# EAGLE design CktoADC (EAGLE 5.11)

## Sheet 1 of 2
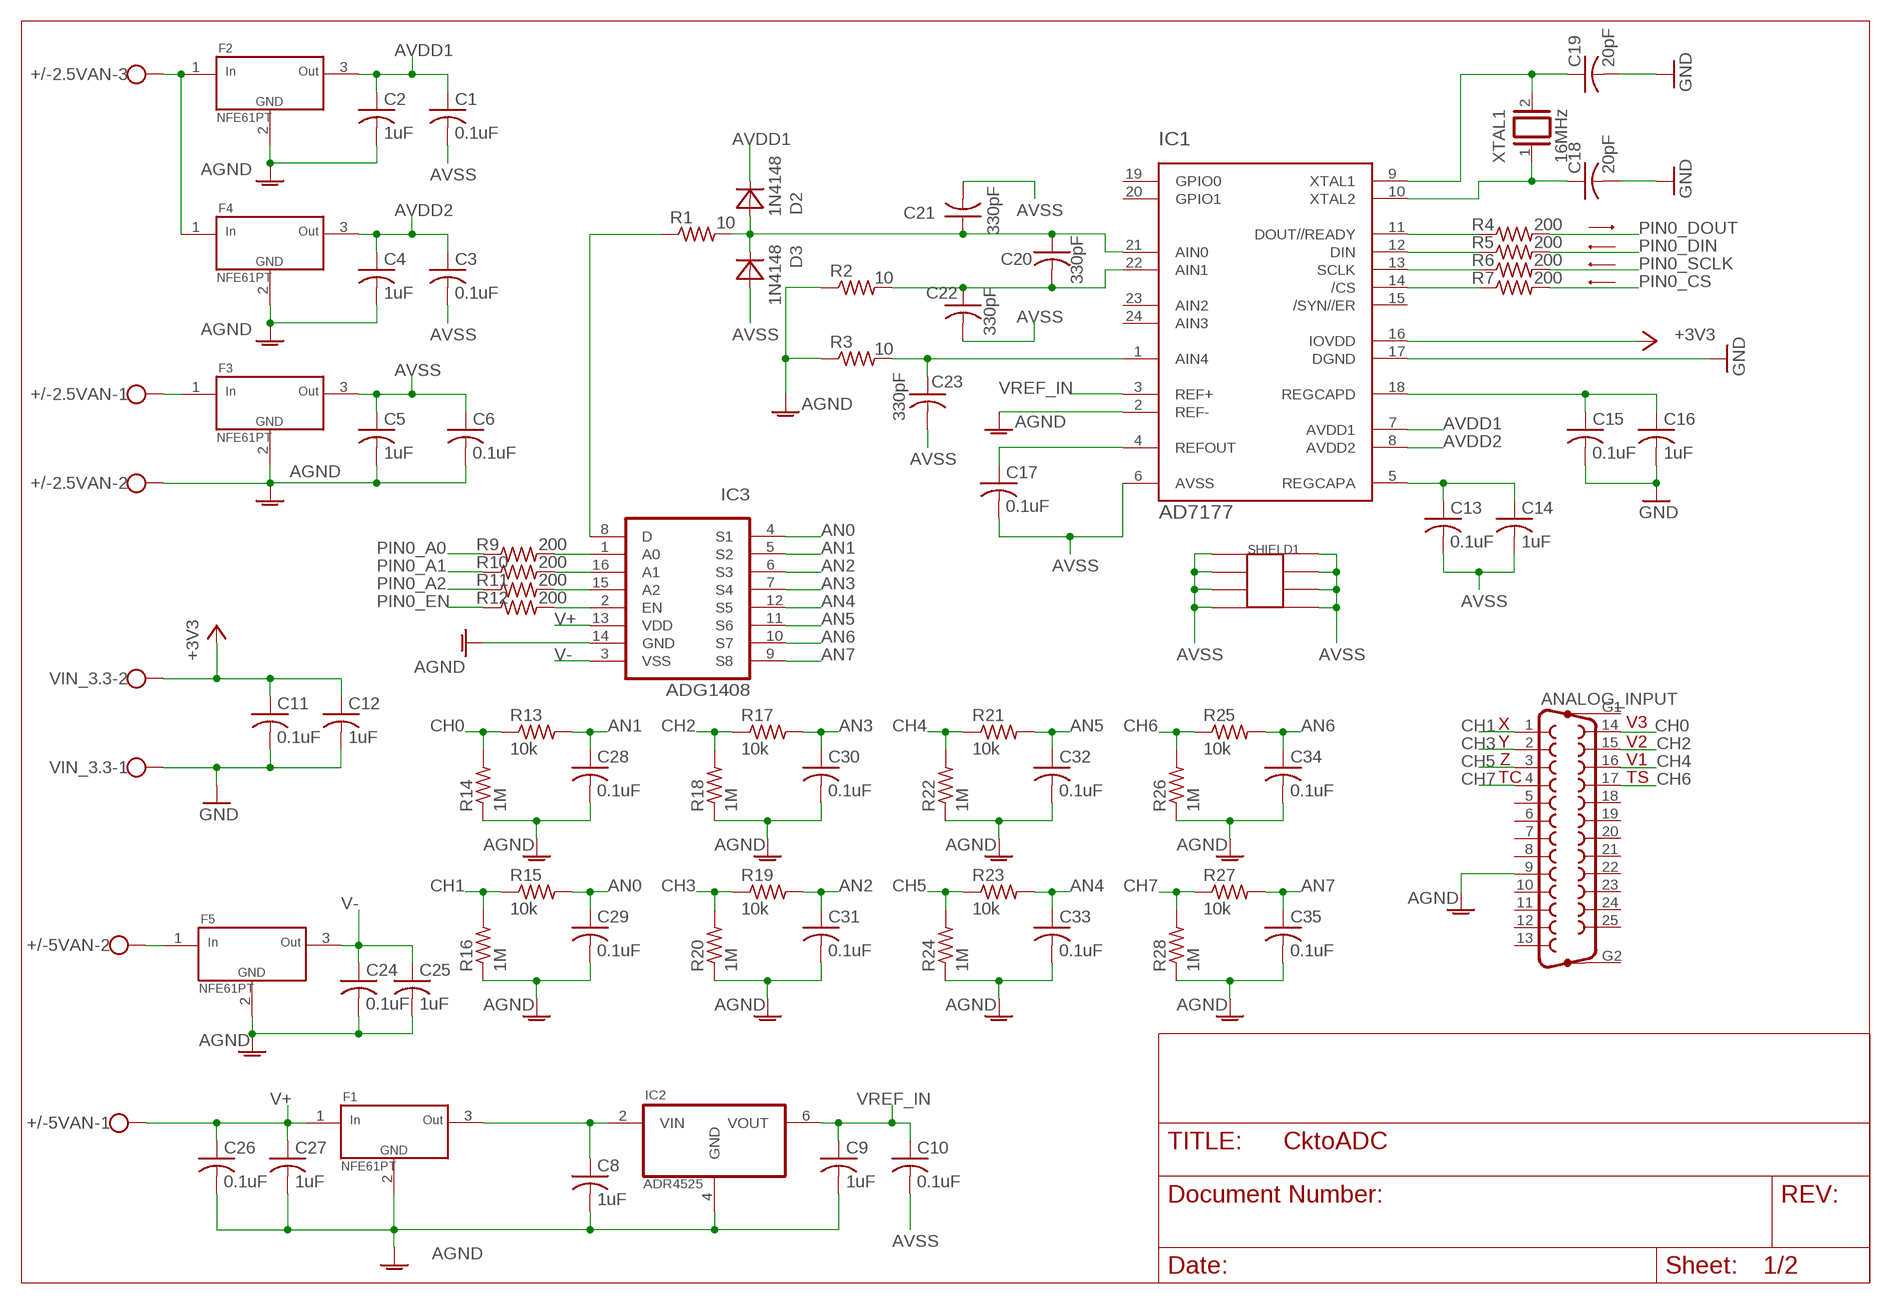
[diagram p0: schematic, sheet 1]

### Parts
+/-2.5VAN  W237-103  [W237-103]
+/-5VAN  W237-102  [W237-102]
ANALOG_INPUT  F25HP  [F25HP]
C1  0.1uF  C-USC0402  [C0402]
C2  1uF  C-USC0603  [C0603]
C3  0.1uF  C-USC0402  [C0402]
C4  1uF  C-USC0603  [C0603]
C5  1uF  C-USC0603  [C0603]
C6  0.1uF  C-USC0402  [C0402]
C8  1uF  C-USC0603  [C0603]
C9  1uF  C-USC0603  [C0603]
C10  0.1uF  C-USC0402  [C0402]
C11  0.1uF  C-USC0402  [C0402]
C12  1uF  C-USC0402  [C0402]
C13  0.1uF  C-USC0402  [C0402]
C14  1uF  C-USC0402  [C0402]
C15  0.1uF  C-USC0402  [C0402]
C16  1uF  C-USC0402  [C0402]
C17  0.1uF  C-USC0402  [C0402]
C18  20pF  C-USC0603  [C0603]
C19  20pF  C-USC0603  [C0603]
C20  330pF  C-USC0805  [C0805]
C21  330pF  C-USC0805  [C0805]
C22  330pF  C-USC0805  [C0805]
C23  330pF  C-USC0805  [C0805]
C24  0.1uF  C-USC0402  [C0402]
C25  1uF  C-USC0402  [C0402]
C26  0.1uF  C-USC0402  [C0402]
C27  1uF  C-USC0402  [C0402]
C28  0.1uF  C-USC0603  [C0603]
C29  0.1uF  C-USC0603  [C0603]
C30  0.1uF  C-USC0603  [C0603]
C31  0.1uF  C-USC0603  [C0603]
C32  0.1uF  C-USC0603  [C0603]
C33  0.1uF  C-USC0603  [C0603]
C34  0.1uF  C-USC0603  [C0603]
C35  0.1uF  C-USC0603  [C0603]
D2  1N4148  DIODE  [DIODE]
D3  1N4148  DIODE  [DIODE]
F1  NFE61PT  EMIFIL  [NFE-2706]
F2  NFE61PT  EMIFIL  [NFE-2706]
F3  NFE61PT  EMIFIL  [NFE-2706]
F4  NFE61PT  EMIFIL  [NFE-2706]
F5  NFE61PT  EMIFIL  [NFE-2706]
IC1  AD7177  AD7177-2  [TSSOP24]
IC2  ADR4525  [SOIC8]
IC3  ADG1408  [TSSOP16]
R1  10  R-US_R0603  [R0603]
R2  10  R-US_R0603  [R0603]
R3  10  R-US_R0603  [R0603]
R4  200  R-US_R0603  [R0603]
R5  200  R-US_R0603  [R0603]
R6  200  R-US_R0603  [R0603]
R7  200  R-US_R0603  [R0603]
R9  200  R-US_R0603  [R0603]
R10  200  R-US_R0603  [R0603]
R11  200  R-US_R0603  [R0603]
R12  200  R-US_R0603  [R0603]
R13  10k  R-US_R0603  [R0603]
R14  1M  R-US_R0603  [R0603]
R15  10k  R-US_R0603  [R0603]
R16  1M  R-US_R0603  [R0603]
R17  10k  R-US_R0603  [R0603]
R18  1M  R-US_R0603  [R0603]
R19  10k  R-US_R0603  [R0603]
R20  1M  R-US_R0603  [R0603]
R21  10k  R-US_R0603  [R0603]
R22  1M  R-US_R0603  [R0603]
R23  10k  R-US_R0603  [R0603]
R24  1M  R-US_R0603  [R0603]
R25  10k  R-US_R0603  [R0603]
R26  1M  R-US_R0603  [R0603]
R27  10k  R-US_R0603  [R0603]
R28  1M  R-US_R0603  [R0603]
SHIELD1  SHIELD_50X38  [SHIELD_38X50]
VIN_3.3  W237-102  [W237-102]
XTAL1  16MHz  XTAL  [XTAL]

### Nets
+3V3: C11.1 C12.1 IC1.16(IOVDD) VIN_3.3.2 ; also sheet 2
AGND: +/-2.5VAN.2 ANALOG_INPUT.9 C2.2 C4.2 C5.2 C6.2 C8.2 C9.2 C24.2 C25.2 C26.2 C27.2 C28.2 C29.2 C30.2 C31.2 C32.2 C33.2 C34.2 C35.2 F1.2 F2.2 F3.2 F4.2 F5.2 IC1.2(REF-) IC2.4(GND) IC3.14(GND) R2.1 R3.1 R14.1 R16.1 R18.1 R20.1 R22.1 R24.1 R26.1 R28.1
AN0: C29.1 IC3.4(S1) R15.2
AN1: C28.1 IC3.5(S2) R13.2
AN2: C31.1 IC3.6(S3) R19.2
AN3: C30.1 IC3.7(S4) R17.2
AN4: C33.1 IC3.12(S5) R23.2
AN5: C32.1 IC3.11(S6) R21.2
AN6: C34.1 IC3.10(S7) R25.2
AN7: C35.1 IC3.9(S8) R27.2
AVDD1: C1.1 C2.1 D2.K F2.3 IC1.7(AVDD1)
AVDD2: C3.1 C4.1 F4.3 IC1.8(AVDD2)
AVSS: C1.2 C3.2 C5.1 C6.1 C10.2 C13.2 C14.2 C17.2 C21.2 C22.2 C23.2 D3.A F3.3 IC1.6(AVSS) SHIELD1.P$1 SHIELD1.P$2 SHIELD1.P$3 SHIELD1.P$4 SHIELD1.P$5 SHIELD1.P$6 SHIELD1.P$7 SHIELD1.P$8
CH0: ANALOG_INPUT.14 R13.1 R14.2
CH1: ANALOG_INPUT.1 R15.1 R16.2
CH2: ANALOG_INPUT.15 R17.1 R18.2
CH3: ANALOG_INPUT.2 R19.1 R20.2
CH4: ANALOG_INPUT.16 R21.1 R22.2
CH5: ANALOG_INPUT.3 R23.1 R24.2
CH6: ANALOG_INPUT.17 R25.1 R26.2
CH7: ANALOG_INPUT.4 R27.1 R28.2
GND: C11.2 C12.2 C15.2 C16.2 C18.2 C19.2 IC1.17(DGND) VIN_3.3.1 ; also sheet 2
N$1: +/-2.5VAN.3 F2.1 F4.1
N$2: +/-2.5VAN.1 F3.1
N$4: C8.1 F1.3 IC2.2(VIN)
N$5: C15.1 C16.1 IC1.18(REGCAPD)
N$6: C20.1 C21.1 D2.A D3.K IC1.21(AIN0) R1.2
N$7: C17.1 IC1.4(REFOUT)
N$8: C13.1 C14.1 IC1.5(REGCAPA)
N$9: C18.1 IC1.10(XTAL2) XTAL1.1
N$10: C19.1 IC1.9(XTAL1) XTAL1.2
N$11: C20.2 C22.1 IC1.22(AIN1) R2.2
N$12: C23.1 IC1.1(AIN4) R3.2
N$13: +/-5VAN.2 F5.1
N$15: IC1.11(DOUT//READY) R4.1
N$16: IC1.12(DIN) R5.1
N$17: IC1.13(SCLK) R6.1
N$18: IC1.14(/CS) R7.1
N$19: IC3.1(A0) R9.2
N$20: IC3.16(A1) R10.2
N$21: IC3.15(A2) R11.2
N$22: IC3.2(EN) R12.2
N$23: IC3.8(D) R1.1
PIN0_A0: R9.1 ; also sheet 2
PIN0_A1: R10.1 ; also sheet 2
PIN0_A2: R11.1 ; also sheet 2
PIN0_CS: R7.2 ; also sheet 2
PIN0_DIN: R5.2 ; also sheet 2
PIN0_DOUT: R4.2 ; also sheet 2
PIN0_EN: R12.1 ; also sheet 2
PIN0_SCLK: R6.2 ; also sheet 2
V+: +/-5VAN.1 C26.1 C27.1 F1.1 IC3.13(VDD)
V-: C24.1 C25.1 F5.3 IC3.3(VSS)
VREF_IN: C9.1 C10.1 IC1.3(REF+) IC2.6(VOUT)
Unconnected: ANALOG_INPUT.5 ANALOG_INPUT.6 ANALOG_INPUT.7 ANALOG_INPUT.8 ANALOG_INPUT.10 ANALOG_INPUT.11 ANALOG_INPUT.12 ANALOG_INPUT.13 ANALOG_INPUT.18 ANALOG_INPUT.19 ANALOG_INPUT.20 ANALOG_INPUT.21 ANALOG_INPUT.22 ANALOG_INPUT.23 ANALOG_INPUT.24 ANALOG_INPUT.25 ANALOG_INPUT.G1 ANALOG_INPUT.G2 IC1.15(/SYN//ER) IC1.19(GPIO0) IC1.20(GPIO1) IC1.23(AIN2) IC1.24(AIN3)

### Notes on the sheet
- X | V3
- Y | V2
- Z | V1
- TC | TS

## Sheet 2 of 2
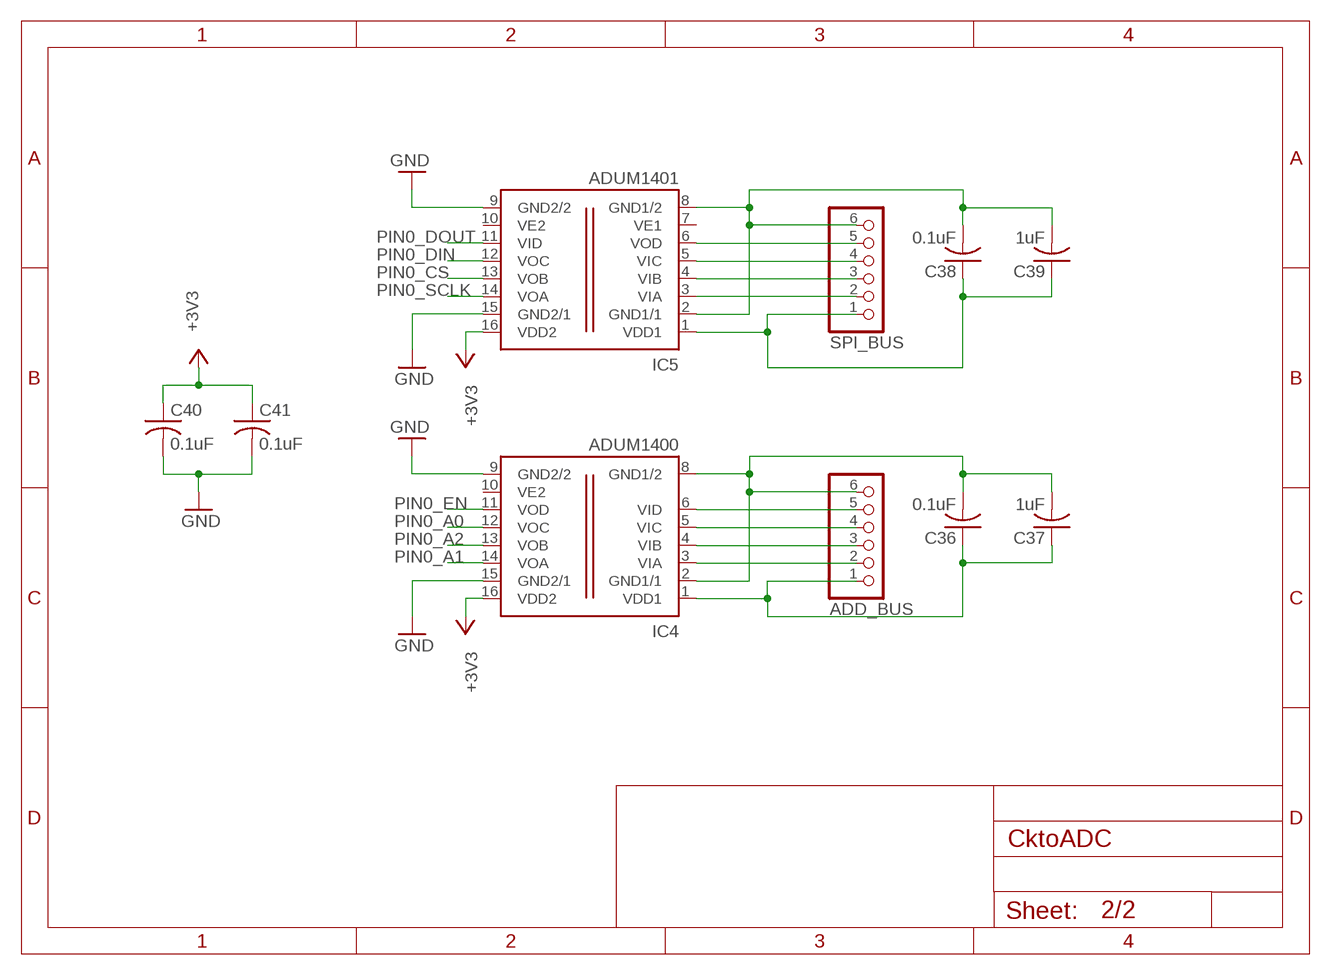
[diagram p1: schematic, sheet 2]

### Parts
ADD_BUS  PINHD-1X6  [1X06]
C36  0.1uF  C-USC0603  [C0603]
C37  1uF  C-USC0603  [C0603]
C38  0.1uF  C-USC0603  [C0603]
C39  1uF  C-USC0603  [C0603]
C40  0.1uF  C-USC0603  [C0603]
C41  0.1uF  C-USC0603  [C0603]
IC4  ADUM1400  [SO-16W]
IC5  ADUM1401  [SO-16W]
SPI_BUS  PINHD-1X6  [1X06]

### Nets
+3V3: C40.1 C41.1 IC4.16(VDD2) IC5.16(VDD2) ; also sheet 1
GND: C40.2 C41.2 IC4.9(GND2/2) IC4.15(GND2/1) IC5.9(GND2/2) IC5.15(GND2/1) ; also sheet 1
N$3: ADD_BUS.2 IC4.3(VIA)
N$24: ADD_BUS.3 IC4.4(VIB)
N$25: ADD_BUS.4 IC4.5(VIC)
N$26: ADD_BUS.5 IC4.6(VID)
N$27: ADD_BUS.1 C36.1 C37.1 IC4.1(VDD1)
N$30: ADD_BUS.6 C36.2 C37.2 IC4.2(GND1/1) IC4.8(GND1/2)
N$34: IC5.3(VIA) SPI_BUS.2
N$35: IC5.4(VIB) SPI_BUS.3
N$36: IC5.5(VIC) SPI_BUS.4
N$37: IC5.6(VOD) SPI_BUS.5
N$38: C38.1 C39.1 IC5.1(VDD1) SPI_BUS.1
N$39: C38.2 C39.2 IC5.2(GND1/1) IC5.8(GND1/2) SPI_BUS.6
PIN0_A0: IC4.12(VOC) ; also sheet 1
PIN0_A1: IC4.14(VOA) ; also sheet 1
PIN0_A2: IC4.13(VOB) ; also sheet 1
PIN0_CS: IC5.13(VOB) ; also sheet 1
PIN0_DIN: IC5.12(VOC) ; also sheet 1
PIN0_DOUT: IC5.11(VID) ; also sheet 1
PIN0_EN: IC4.11(VOD) ; also sheet 1
PIN0_SCLK: IC5.14(VOA) ; also sheet 1
Unconnected: IC4.10(VE2) IC5.7(VE1) IC5.10(VE2)

## Library data of the parts
+/-2.5VAN = con-wago-500:W237-103: WAGO SCREW CLAMP; MPN: 237-103; OC_FARNELL: unknown; OC_NEWARK: 18M7116
+/-5VAN VIN_3.3 = con-wago-500:W237-102: WAGO SCREW CLAMP; MPN: 237-102; OC_FARNELL: unknown; OC_NEWARK: 70K9898
ADD_BUS SPI_BUS = pinhead:PINHD-1X6: PIN HEADER
ANALOG_INPUT = con-subd:F25HP: SUB-D; OC_FARNELL: unknown; OC_NEWARK: unknown
C1-C6 C8-C41 = rcl:C-US: CAPACITOR, American symbol
D2 D3 = Ricardo_Library:DIODE
F1-F5 = magnetometro:EMIFIL
IC1 = magnetometro:AD7177-2
IC2 = magnetometro:ADR4525
IC3 = magnetometro:ADG1408
IC4 = Ricardo_Library:ADUM1400
IC5 = Ricardo_Library:ADUM1401
R1-R7 R9-R28 = rcl:R-US_: RESISTOR, American symbol
SHIELD1 = magnetometro:SHIELD_50X38
XTAL1 = Ricardo_Library:XTAL

## Board
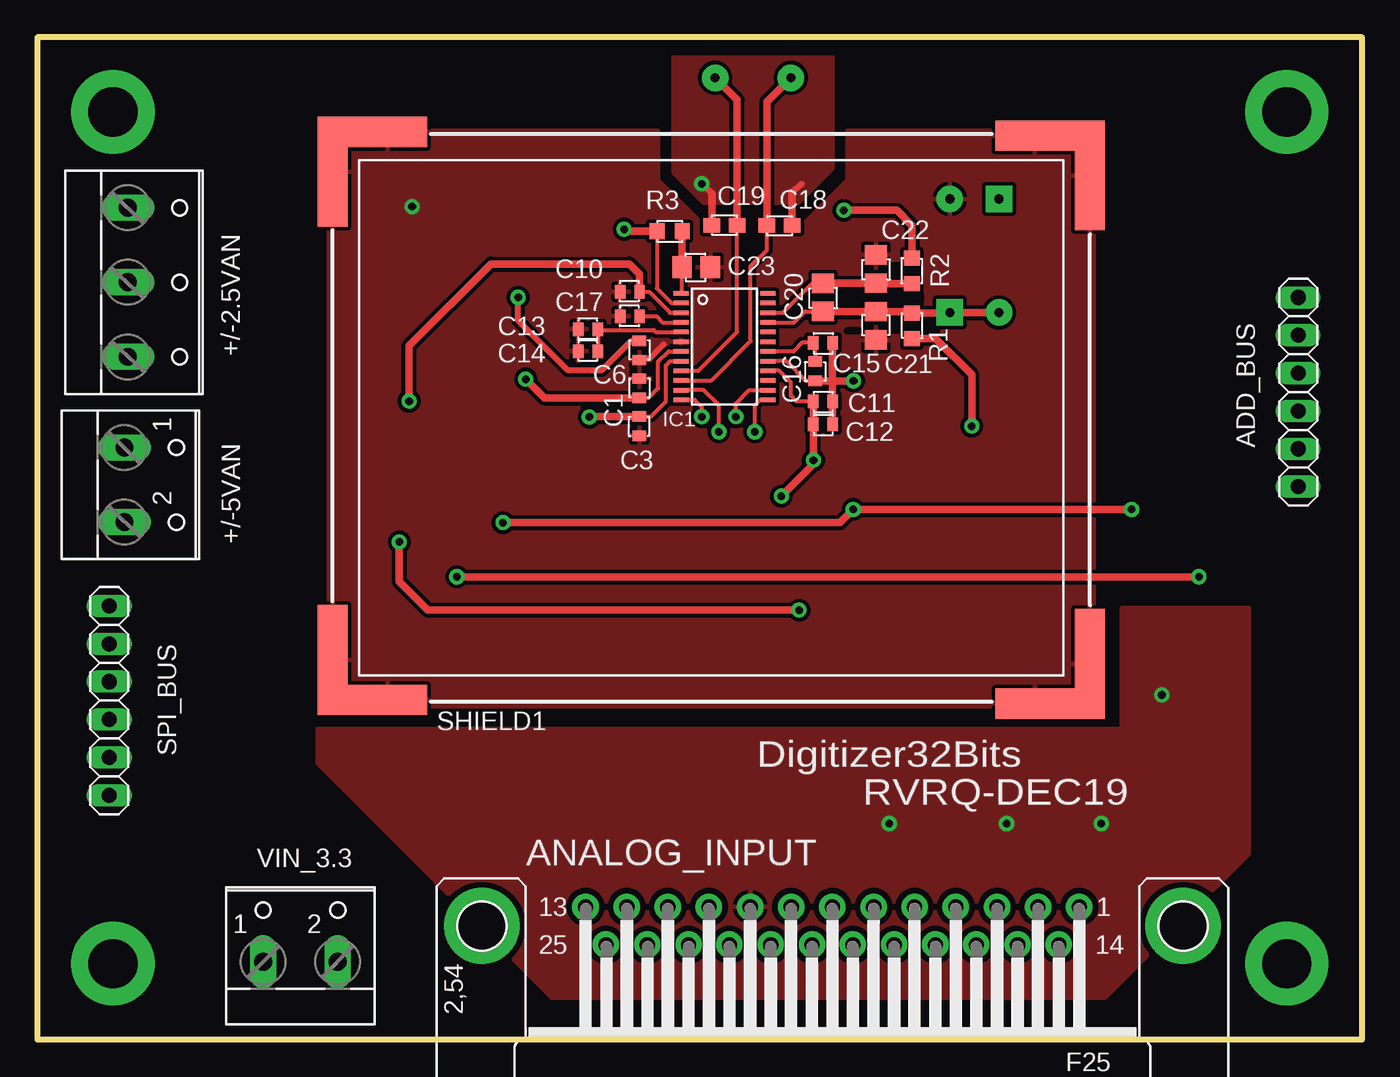
[diagram p2: board, top side]
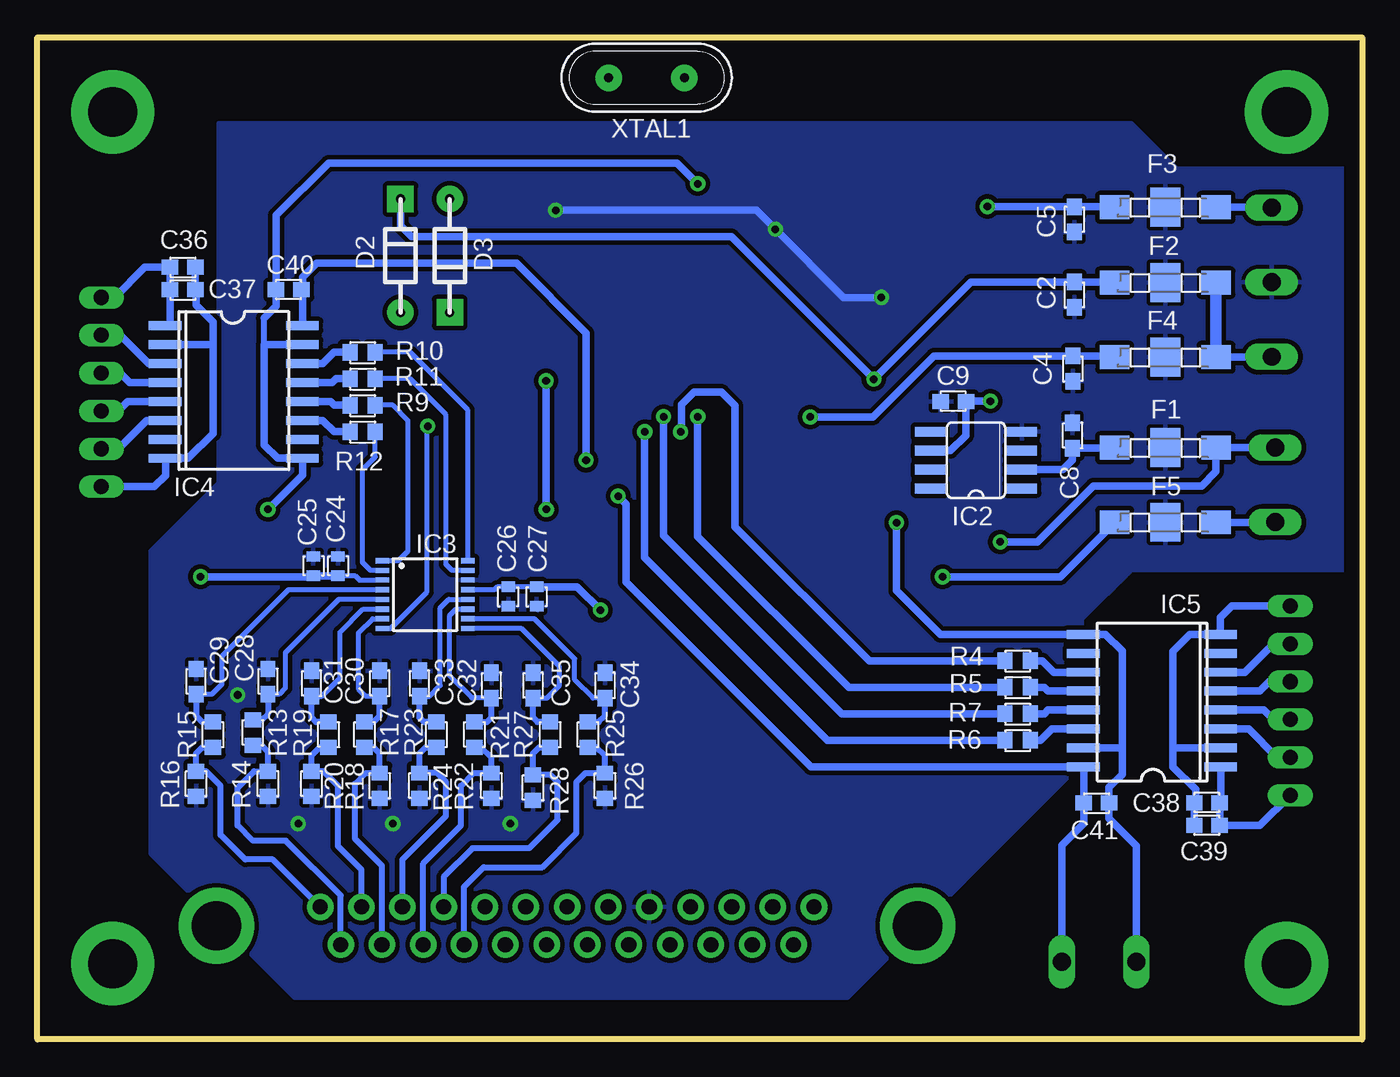
[diagram p3: board, bottom side, seen from below]

Size 88.88 x 67.23 mm. Coordinates in mm from the lower left corner, seen from the top.
Outline: 0,0 88.88,0 88.88,67.23 0,67.23 0,0
Copper layers (1*16): Top 0.035mm / dielectric 1.5mm / Bottom 0.035mm
Design rules "default": minimum track width 10mil, minimum drill 24mil, track to track 8mil, track to pad 8mil, pad to pad 8mil, via to via 8mil, smd to smd 8mil, copper to edge 40mil, drill to drill 8mil, minimum pad ring 10mil, minimum via ring 8mil, stop-mask expansion 4mil, vias tented up to drill 0mil, thermal gap 10mil
tRestrict: 4 lines
bRestrict: 1 lines

### Footprints (pad centres in the part's own frame; a part is rotated, then mirrored left to right if it is on the bottom)
W237-103 = drill 1.194 long: 1 -5,-1.29; 2 0,-1.29; 3 5,-1.29
W237-102 = drill 1.194 long: 1 -2.5,-1.27; 2 2.5,-1.27
1X06 = drill 1.016 long: 1 -6.35,0; 2 -3.81,0; 3 -1.27,0; 4 1.27,0; 5 3.81,0; 6 6.35,0
F25HP = drill 1.016 pad 1.778 round: 1 -16.561,-1.27; 2 -13.792,-1.27; 3 -11.049,-1.27; 4 -8.28,-1.27; 5 -5.512,-1.27; 6 -2.769,-1.27; 7 0,-1.27; 8 2.769,-1.27; 9 5.512,-1.27; 10 8.28,-1.27; 11 11.049,-1.27; 12 13.792,-1.27; 13 16.561,-1.27; 14 -15.189,1.27; 15 -12.421,1.27; 16 -9.652,1.27; 17 -6.909,1.27; 18 -4.14,1.27; 19 -1.372,1.27; 20 1.372,1.27; 21 4.14,1.27; 22 6.909,1.27; 23 9.652,1.27; 24 12.421,1.27; 25 15.189,1.27 | drill 3.302 pad 5.08 round: G1 -23.52,0; G2 23.52,0
C0402 = smd 0.7 x 0.9: 1 -0.65,0; 2 0.65,0
C0603 = smd 1.1 x 1: 1 -0.85,0; 2 0.85,0
C0805 = smd 1.3 x 1.5: 1 -0.95,0; 2 0.95,0
DIODE = drill 0.61 pad 1.778 round: A -3.81,0 | drill 0.61 pad 1.778 square: K 3.81,0
NFE-2706 = smd 2 x 1.6: 1 -3.4,0; 3 3.4,0 | smd 2 x 2.6: 2 0,0
TSSOP24 = smd 0.305 x 0.991: 1 -3.575,-2.918; 2 -2.925,-2.918; 3 -2.275,-2.918; 4 -1.625,-2.918; 5 -0.975,-2.918; 6 -0.325,-2.918; 7 0.325,-2.918; 8 0.975,-2.918; 9 1.625,-2.918; 10 2.275,-2.918; 11 2.925,-2.918; 12 3.575,-2.918; 13 3.575,2.918; 14 2.925,2.918; 15 2.275,2.918; 16 1.625,2.918; 17 0.975,2.918; 18 0.325,2.918; 19 -0.325,2.918; 20 -0.975,2.918; 21 -1.625,2.918; 22 -2.275,2.918; 23 -2.925,2.918; 24 -3.575,2.918
SOIC8 = smd 0.66 x 2.032: 1 -1.905,-3.073; 2 -0.635,-3.073; 3 0.635,-3.073; 4 1.905,-3.073; 5 1.905,3.073; 6 0.635,3.073; 7 -0.635,3.073; 8 -1.905,3.073
TSSOP16 = smd 0.9 x 0.35: 1 -2.875,2.275; 2 -2.875,1.625; 3 -2.875,0.975; 4 -2.875,0.325; 5 -2.875,-0.325; 6 -2.875,-0.975; 7 -2.875,-1.625; 8 -2.875,-2.275; 9 2.875,-2.275; 10 2.875,-1.625; 11 2.875,-0.975; 12 2.875,-0.325; 13 2.875,0.325; 14 2.875,0.975; 15 2.875,1.625; 16 2.875,2.275
SO-16W = smd 0.6 x 2.2: 1 -4.445,-4.6; 2 -3.175,-4.6; 3 -1.905,-4.6; 4 -0.635,-4.6; 5 0.635,-4.6; 6 1.905,-4.6; 7 3.175,-4.6; 8 4.445,-4.6; 9 4.445,4.6; 10 3.175,4.6; 11 1.905,4.6; 12 0.635,4.6; 13 -0.635,4.6; 14 -1.905,4.6; 15 -3.175,4.6; 16 -4.445,4.6
R0603 = smd 1 x 1.1: 1 -0.85,0; 2 0.85,0
SHIELD_38X50 = smd 7.366 x 2.032: P$1 2.54,0; P$2 35.306,0; P$3 35.56,50.8; P$4 2.794,50.8 | smd 2.032 x 5.334: P$5 0.127,47.117; P$6 -0.127,3.683; P$7 37.973,3.683; P$8 38.227,47.117
XTAL = drill 0.61 pad 1.778 round: 1 -2.54,0; 2 2.54,0

### Placement (x,y rotation side)
+/-2.5VAN  7.37,50.8 270 top
+/-5VAN  7.11,37.21 270 top
ADD_BUS  84.58,43.43 270 top
ANALOG_INPUT  53.34,7.62 180 top
C1  40.39,43.69 90 top
C2  19.3,49.96 270 bottom
C3  40.39,41.15 270 top
C4  19.41,45.01 270 bottom
C5  19.3,55.02 270 bottom
C6  40.39,46.23 90 top
C8  19.43,40.51 90 bottom
C9  27.43,42.8 180 bottom
C10  39.75,50.16 180 top
C11  52.7,42.8 0 top
C12  52.7,41.27 0 top
C13  36.96,47.65 180 top
C14  36.96,46.18 180 top
C15  52.7,46.74 0 top
C16  52.2,44.83 270 top
C17  39.75,48.51 180 top
C18  49.78,54.61 0 top
C19  46.1,54.61 180 top
C20  52.7,49.78 90 top
C21  56.26,47.88 270 top
C22  56.26,51.69 90 top
C23  44.2,51.82 0 top
C24  68.71,31.75 90 bottom
C25  70.36,31.75 90 bottom
C26  57.28,29.72 270 bottom
C27  55.37,29.72 270 bottom
C28  73.41,24 90 bottom
C29  78.23,24 90 bottom
C30  65.91,23.88 90 bottom
C31  70.48,23.88 90 bottom
C32  58.42,23.75 90 bottom
C33  63.25,23.88 90 bottom
C34  50.8,23.75 90 bottom
C35  55.63,23.75 90 bottom
C36  79.12,51.82 0 bottom
C37  79.12,50.29 0 bottom
C38  10.41,15.88 180 bottom
C39  10.41,14.35 180 bottom
C40  72.01,50.29 180 bottom
C41  17.83,15.88 0 bottom
D2  64.52,52.58 90 bottom
D3  61.21,52.58 270 bottom
F1  13.21,39.7 180 bottom
F2  13.21,50.77 180 bottom
F3  13.21,55.83 180 bottom
F4  13.21,45.77 180 bottom
F5  13.21,34.7 180 bottom
IC1  46.1,46.48 270 top
IC2  25.91,38.86 90 bottom
IC3  62.87,29.84 0 bottom
IC4  75.69,43.43 270 bottom
IC5  14.1,22.73 90 bottom
R1  58.67,47.88 90 top
R2  58.67,51.56 270 top
R3  42.42,54.23 0 top
R4  23.11,25.4 0 bottom
R5  23.11,23.62 0 bottom
R6  23.11,20.07 0 bottom
R7  23.11,21.84 0 bottom
R9  67.06,42.55 0 bottom
R10  67.06,46.1 0 bottom
R11  67.06,44.32 0 bottom
R12  67.06,40.77 0 bottom
R13  74.42,20.57 90 bottom
R14  73.41,17.14 90 bottom
R15  77.09,20.45 90 bottom
R16  78.23,17.14 90 bottom
R17  66.93,20.45 90 bottom
R18  65.91,17.02 90 bottom
R19  69.34,20.45 90 bottom
R20  70.48,17.14 90 bottom
R21  59.56,20.45 90 bottom
R22  58.42,17.02 90 bottom
R23  62.1,20.45 90 bottom
R24  63.25,17.02 90 bottom
R25  51.94,20.45 90 bottom
R26  50.8,17.02 90 bottom
R27  54.48,20.45 90 bottom
R28  55.63,16.89 90 bottom
SHIELD1  70.61,22.66 90 top
SPI_BUS  4.83,22.73 90 top
VIN_3.3  17.65,6.48 0 top
XTAL1  48.01,64.52 0 bottom

### Tracks (layer width: path | path; a pad name or v marks a point on that pad's centre or on a via)
+3V3  (via drill 0.51 pad 1.02)
  Top 0.254: IC1.16 49.76,44.86 50.55,44.07 50.55,43.18 50.93,42.8 C11.1
  Top 0.508: C11.1 C12.1 52.07,41.26 v52.07,38.86 52.07,38.61 v49.91,36.45
  Bottom 0.508: VIN_3.3.2 20.15,13.02 18.68,14.49 C41.1 18.68,18.27 IC5.16 36.98,18.29 49.38,30.68 49.38,35.92 v49.91,36.45 | 71.09,50.23 C40.1 | 71.09,50.23 71.09,51.13 70.16,52.07 56.74,52.07 52.07,47.4 v52.07,38.86 | 71.09,50.23 IC4.16
AGND  (via drill 0.51 pad 1.02)
  Top 0.254: IC1.2 42.54,49.41 41.57,50.38 R3.1
  Top 0.406: C6.2 39.87,46.88 37.9,44.91 35.56,44.91 32.26,48.21 v32.26,49.78
  Top 0.508: R2.1 58.67,54.61 57.66,55.63 v54.1,55.63 | v39.37,54.36 39.5,54.23 R3.1
  Bottom 0.508: v54.1,55.63 40.64,55.63 v39.37,54.36 34.8,49.78 v32.26,49.78
  other vias: 57.15,14.48 65.02,14.48 71.37,14.48 75.44,23.11
  pour Bottom (isolate 0.305): 0,58.42 12.45,58.42 15.49,61.47 76.71,61.47 76.71,37.34 81.28,32.77 81.28,12.45 71.63,2.79 34.54,2.79 18.8,18.54 18.8,28.19 15.49,31.5 0,31.5
  pour Top (isolate 0.381): 72.77,28.96 81.28,28.96 81.28,12.45 71.63,2.79 34.54,2.79 18.8,18.54 18.8,20.83 72.77,20.83
AN0
  Bottom 0.33: IC3.4 72.04,30.17 76.5,25.7 76.5,23.82 77.18,23.15 C29.1
  Bottom 0.406: R15.2 77.81,21.3 78.23,21.72 C29.1
AN1
  Bottom 0.33: IC3.5 68.65,29.52 72.24,25.93 72.24,23.57 72.66,23.15 C28.1
  Bottom 0.406: R13.2 73.83,21.42 73.41,21.84 C28.1
AN2
  Bottom 0.33: IC3.6 67.02,28.87 68.58,27.3 68.58,24.26 69.81,23.03 C31.1
  Bottom 0.406: R19.2 70.19,21.3 70.48,21.59 C31.1
AN3
  Bottom 0.33: IC3.7 66.39,28.22 67.31,27.3 67.31,23.5 66.84,23.03 C30.1
  Bottom 0.406: R17.2 66.33,21.3 65.91,21.72 C30.1
AN4
  Bottom 0.33: C33.1 62.57,23.03 61.85,23.75 61.85,28.96 61.28,29.52 IC3.12
  Bottom 0.406: R23.2 62.95,21.3 63.25,21.59 C33.1
AN5
  Bottom 0.33: IC3.11 60.79,28.87 61.21,28.45 61.21,24.38 59.73,22.9 C32.1
  Bottom 0.406: R21.2 58.71,21.3 58.42,21.59 C32.1
AN6
  Bottom 0.33: C34.1 51.6,22.9 52.83,24.13 52.83,25.53 55.52,28.22 IC3.10
  Bottom 0.406: R25.2 51.22,21.3 50.8,21.72 C34.1
AN7
  Bottom 0.33: C35.1 54.7,22.9 53.85,23.75 53.85,25.02 56.4,27.57 IC3.9
  Bottom 0.406: R27.2 55.33,21.3 55.63,21.59 C35.1
AVDD1  (via drill 0.51 pad 1.02)
  Top 0.254: IC1.7 42.35,46.16 41.66,45.47 41.66,43.69 41.01,43.04 C1.1
  Top 0.508: C1.1 34.03,43.04 v32.77,44.3
  Bottom 0.508: 16.61,50.81 C2.1 26.25,50.81 v32.77,44.3 42.32,53.85 63.75,53.85 64.52,54.61 D2.K
  Bottom 0.762: F2.3 16.61,50.81
AVDD2  (via drill 0.51 pad 1.02)
  Top 0.254: IC1.8 42.46,45.51 42.16,45.21 42.16,42.8 41.16,41.8 C3.1
  Top 0.508: v37.03,41.76 37.07,41.8 C3.1
  Bottom 0.508: 16.61,45.86 C4.1 28.72,45.86 32.82,41.76 v37.03,41.76
  Bottom 0.762: F4.3 16.61,45.86
AVSS  (via drill 0.51 pad 1.02)
  Top 0.406: 40.13,45.72 41.1,45.72 42.01,46.63
  Bottom 0.508: F3.3 16.64,55.87 C5.1 19.32,55.88 v25.15,55.88
  pour Top (isolate 0.254): 19.56,60.96 41.66,60.96 41.66,57.66 44.45,54.86 51.56,54.86 54.36,57.66 54.36,60.96 70.87,60.96 70.87,22.35 19.56,22.35
CH0
  Bottom 0.406: R13.1 73.83,19.72 73.41,19.3 R14.2 74.33,18 75.44,16.89 75.44,14.35 74.42,13.34 72.21,13.34 68.53,9.65 ANALOG_INPUT.14
CH1
  Bottom 0.406: ANALOG_INPUT.1 73.08,12.06 74.93,12.06 76.58,13.72 76.58,17.02 77.56,18 R16.2 78.23,19.18 77.81,19.6 R15.1
CH2
  Bottom 0.406: ANALOG_INPUT.15 65.76,11.66 67.56,13.46 67.56,17.14 66.84,17.87 R18.2 65.91,19.18 66.33,19.6 R17.1
CH3
  Bottom 0.406: ANALOG_INPUT.2 67.13,11.38 68.71,12.95 68.71,17.02 69.68,18 R20.2 70.48,19.05 69.94,19.6 R19.1
CH4
  Bottom 0.406: ANALOG_INPUT.16 62.99,11.81 60.45,14.35 60.45,17.02 59.6,17.87 R22.2 58.42,18.92 59.09,19.6 R21.1
CH5
  Bottom 0.406: ANALOG_INPUT.3 64.39,12.06 61.47,14.99 61.47,17.27 62.06,17.87 R24.2 63.25,19.18 62.83,19.6 R23.1
CH6
  Bottom 0.406: ANALOG_INPUT.17 60.25,10.24 58.93,11.56 54.99,11.56 52.7,13.84 52.7,17.27 52.11,17.87 R26.2 50.8,19.05 51.35,19.6 R25.1
CH7
  Bottom 0.406: ANALOG_INPUT.4 61.62,10.9 59.69,12.83 55.88,12.83 53.98,14.73 53.98,17.27 54.44,17.74 R28.2 55.63,19.18 55.21,19.6 R27.1
GND  (via drill 0.51 pad 1.02)
  Top 0.254: IC1.17 50.25,45.51 51.58,44.18 C16.2
  Top 0.406: v44.58,57.4 45.25,56.73 | 50.63,56.86 51.28,57.4 | 53.34,42.81 C11.2 | 53.34,46.72 C15.2
  Top 0.508: 45.25,56.73 C19.2 | C18.2 50.63,56.86 | 53.34,44.18 C16.2 | C11.2 C12.2 | 53.34,44.18 53.34,42.81 | 53.34,44.18 53.34,46.72 | v54.75,44.18 53.34,44.18 | v73.41,35.56 v54.74,35.56 53.85,34.67 v31.24,34.67
  Bottom 0.406: 73.66,46.61 73.66,48.39 | 54.74,44.17 v54.75,44.18
  Bottom 0.508: VIN_3.3.1 15.15,12.99 16.98,14.82 C41.2 16.98,16.9 16.1,17.78 16.1,19.56 | 73.66,48.39 72.86,49.19 C40.2 72.86,55.28 69.34,58.8 45.97,58.8 v44.58,57.4 | IC4.15 73.66,46.61 73.66,39.88 72.77,38.99 IC4.9 71.09,37.87 v73.41,35.56 | v54.74,35.56 54.74,44.17 | IC5.9 28.3,27.18 31.24,30.12 v31.24,34.67 | IC5.9 18.65,27.13 | IC5.9 17.22,27.18 16.1,26.06 16.1,19.56 | 16.1,19.56 IC5.15
  pour Top (isolate 0.254): 42.67,67.31 53.34,67.31 53.34,58.42 51.05,56.13 44.7,56.13 42.67,58.17
N$1
  Bottom 0.508: +/-2.5VAN.3 6.08,45.77 F4.1
  Bottom 0.762: F4.1 F2.1
N$2
  Bottom 0.508: 6.08,55.83 F3.1
  Bottom 0.762: +/-2.5VAN.1 6.08,55.83
N$3
  Bottom 0.508: IC4.3 81.41,45.34 83.31,47.24 ADD_BUS.2
N$4
  Bottom 0.508: F1.3 16.64,39.66 C8.1 19.43,38.89 20.09,38.23 IC2.2
N$5
  Top 0.254: IC1.18 50.73,46.16 51.31,46.74 C15.1 52.2,46.59 C16.1
N$6
  Top 0.254: IC1.21 50.77,48.11 51.5,48.83 C20.1
  Top 0.508: C20.1 C21.1 | C21.1 58.67,48.83 | D3.K D2.A | R1.2 61.17,48.73
  Top 0.762: C21.1 | 58.67,48.83 R1.2 | 61.17,48.73 D3.K
N$7
  Top 0.254: IC1.4 41.94,48.11 41.53,48.51 C17.1
N$8
  Top 0.254: IC1.5 41.49,47.46 41.35,47.6 37.61,47.6 C13.1 C14.1
N$9
  Top 0.254: IC1.10 45.22,44.21 47.85,46.84 47.85,51.87 48.93,52.95 C18.1
  Top 0.508: C18.1 48.93,62.9 XTAL1.1
N$10
  Top 0.254: IC1.9 44.35,44.86 46.95,47.46 C19.1
  Top 0.508: C19.1 46.95,63.03 XTAL1.2
N$11
  Top 0.254: IC1.22 50.03,48.76 52,50.73 C20.2
  Top 0.508: C20.2 C22.1 | 56.29,50.71 R2.2
  Top 0.762: C20.2 | C22.1 56.29,50.71
N$12
  Top 0.254: IC1.1 43.25,50.12 C23.1
  Top 0.508: C23.1 43.25,54.21
  Top 0.762: 43.25,54.21 R3.2
N$13
  Bottom 0.508: +/-5VAN.2 5.86,34.7 F5.1
N$15  (via drill 0.51 pad 1.02)
  Top 0.254: v45.72,40.77 45.72,42.55 44.71,43.56 IC1.11
  Bottom 0.508: v45.72,40.77 45.66,40.83 45.66,42.61 44.83,43.43 42.98,43.43 42.06,42.52 42.06,34.39 33.07,25.4 R4.1
N$16  (via drill 0.51 pad 1.02)
  Top 0.254: IC1.12 44.09,42.91 44.58,42.42 v44.58,41.78
  Bottom 0.508: R5.1 34.44,23.62 44.58,33.76 v44.58,41.78
N$17  (via drill 0.51 pad 1.02)
  Top 0.254: IC1.13 48.49,42.91 48.13,42.55 v48.13,40.77
  Bottom 0.508: R6.1 35.87,20.07 48.13,32.33 v48.13,40.77
N$18  (via drill 0.51 pad 1.02)
  Top 0.254: IC1.14 47.75,43.56 46.86,42.67 v46.86,41.78
  Bottom 0.508: R7.1 34.9,21.84 46.86,33.81 v46.86,41.78
N$19
  Bottom 0.33: IC3.1 64.65,32.12 64.01,32.77 64.01,41.53 65.02,42.55 R9.2
N$20
  Bottom 0.33: IC3.16 59.99,42.21 63.88,46.1 R10.2
N$21
  Bottom 0.33: IC3.15 61.06,31.47 61.47,31.88 61.47,41.91 63.88,44.32 R11.2
N$22
  Bottom 0.33: IC3.2 66.52,31.47 67.06,32 67.06,38.23 66.21,39.08 R12.2
N$23  (via drill 0.51 pad 1.02)
  Top 0.508: v62.69,41.15 62.69,44.6 60.26,47.03 R1.1
  Bottom 0.33: IC3.8 65.19,27.57 62.74,30.02 62.74,41.15 v62.69,41.15
N$24
  Bottom 0.508: IC4.4 82.68,44.07 83.31,44.7 ADD_BUS.3
N$25
  Bottom 0.508: IC4.5 82.8,42.8 83.44,42.16 ADD_BUS.4
N$26
  Bottom 0.508: IC4.6 81.53,41.53 83.44,39.62 ADD_BUS.5
N$27
  Bottom 0.508: ADD_BUS.1 83.69,49.78 81.66,51.82 C36.1 C37.1 79.97,47.88 IC4.1
N$30
  Bottom 0.508: ADD_BUS.6 81.03,37.08 80.26,37.85 80.26,38.96 IC4.8 78.74,38.99 77.09,40.64 77.09,46.48 | IC4.2 77.22,46.61 77.09,46.48 | 77.09,46.48 77.09,48.13 78.23,49.28 78.23,50.25 C37.2 C36.2
N$31  (via drill 3.3 pad 5.59)
  other vias: 5.08,5.08
N$32  (via drill 3.3 pad 5.59)
  other vias: 5.08,62.23
N$33  (via drill 3.3 pad 5.59)
  other vias: 83.82,62.23
N$34
  Bottom 0.508: IC5.3 7.62,20.83 5.71,18.92 SPI_BUS.2
N$35
  Bottom 0.508: IC5.4 6.6,22.1 5.97,21.46 SPI_BUS.3
N$36
  Bottom 0.508: IC5.5 6.86,23.37 6.22,24 SPI_BUS.4
N$37
  Bottom 0.508: IC5.6 7.87,24.64 5.97,26.54 SPI_BUS.5
N$38
  Bottom 0.508: SPI_BUS.1 6.86,14.35 C39.1 C38.1 9.5,15.94 IC5.1
N$39
  Bottom 0.508: SPI_BUS.6 8.76,29.08 9.53,28.32 9.53,27.21 IC5.8 11.56,27.18 12.7,26.04 12.7,19.43 | 12.7,19.43 12.7,18.29 11.18,16.76 11.18,15.96 C38.2 C39.2 | IC5.2 12.57,19.56 12.7,19.43
N$42  (via drill 3.3 pad 5.59)
  other vias: 83.82,5.08
PIN0_A0
  Bottom 0.508: IC4.12 69.22,42.8 68.96,42.55 R9.1
PIN0_A1
  Bottom 0.508: IC4.14 69.72,45.34 68.96,46.1 R10.1
PIN0_A2
  Bottom 0.508: IC4.13 69.09,44.07 68.83,44.32 R11.1
PIN0_CS
  Bottom 0.508: IC5.13 21.08,22.1 21.34,21.84 R7.2
PIN0_DIN
  Bottom 0.508: IC5.12 21.08,23.37 21.34,23.62 R5.2
PIN0_DOUT
  Bottom 0.508: IC5.11 20.7,24.64 21.46,25.4 R4.2
PIN0_EN
  Bottom 0.508: IC4.11 69.72,41.53 68.96,40.77 R12.1
PIN0_SCLK
  Bottom 0.508: IC5.14 20.83,20.83 21.59,20.07 R6.2
V+  (via drill 0.51 pad 1.02)
  Top 0.508: v51.1,28.8 26.19,28.8 24.28,30.71 v24.28,33.38
  Bottom 0.33: IC3.13 58.22,30.17 58.04,30.35 57.29,30.35 C26.1 C27.1
  Bottom 0.508: +/-5VAN.1 5.85,39.7 F1.1 9.81,38.1 10.77,37.13 18.03,37.13 21.79,33.38 v24.28,33.38 | v51.1,28.8 52.67,30.37 C27.1
V-  (via drill 0.51 pad 1.02)
  Top 0.508: v28.14,31.04 v77.93,31.04
  Bottom 0.33: IC3.3 67.27,30.82 67.56,31.11 68.71,31.11 C24.1
  Bottom 0.508: F5.3 20.27,31.04 v28.14,31.04 | v77.93,31.04 70.36,31.04 C25.1 C24.1
VREF_IN  (via drill 0.51 pad 1.02)
  Top 0.254: IC1.3 42.43,48.76 41.02,50.16 C10.1
  Top 0.508: C10.1 40.4,51.34 39.73,52.02 30.43,52.02 24.94,46.53 v24.94,42.82
  Bottom 0.508: v24.94,42.82 26.56,42.82 C9.1 26.58,40.52 27.61,39.5 IC2.6

### Text on the board
tPlace: Digitizer32Bits | RVRQ-DEC19